# Altium schematic sheet imu.SchDoc: Inertial Measurement Unit
size A4; Author: Samuel López; DocumentNumber: 4; SheetNumber: 4; SheetTotal: 6
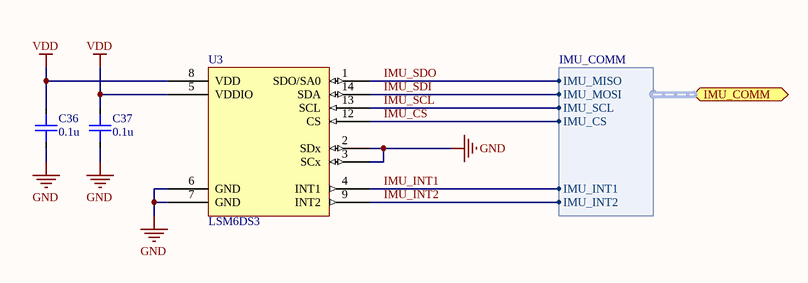
[diagram p0: imu.SchDoc]

## Parts
C36  0.1u  [C0402]
C37  0.1u  [C0402]
U3  LSM6DS3  [LSM6DS3]

## Ports
IMU_COMM (harness IMU_COMM)

## Harnesses
IMU_COMM: IMU_SCL, IMU_MOSI, IMU_MISO, IMU_CS, IMU_INT1, IMU_INT2

## Nets
GND: C36.1 C37.1 U3.2(SDx) U3.3(SCx) U3.6(GND) U3.7(GND)
VDD: C36.2 C37.2 U3.5(VDDIO) U3.8(VDD)
IMU_CS: U3.12(CS) ; port IMU_COMM.IMU_CS
IMU_INT1: U3.4(INT1) ; port IMU_COMM.IMU_INT1
IMU_INT2: U3.9(INT2) ; port IMU_COMM.IMU_INT2
IMU_SCL: U3.13(SCL) ; port IMU_COMM.IMU_SCL
IMU_SDI: U3.14(SDA) ; port IMU_COMM.IMU_MOSI
IMU_SDO: U3.1(SDO/SA0) ; port IMU_COMM.IMU_MISO

## Notes on the sheet
- Title:
- Sheet
- of
- Author:
- Date:
- Time:

## Library data of the parts
C36 C37 = Capacitor: Value: 0.1u; Rated Voltage: *
U3 = LSM6DS3: IC - Inertial Measurement Unit, Accelerometer, Gyroscope, 6D; Supplier 1: Digi-Key; Supplier Part Number 1: 497-15383-1-ND